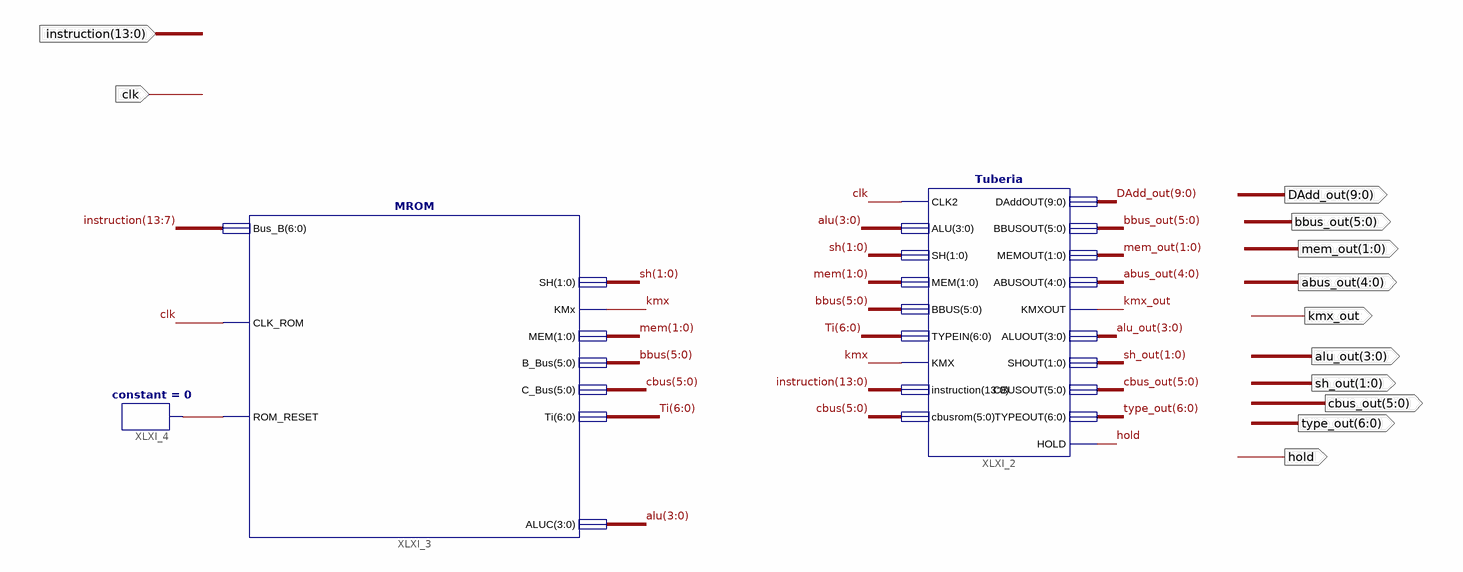
[diagram p0: schematic sheet 1]
// Xilinx ISE schematic merge.sch (artix7) as structural Verilog: 3 symbols, 12 ports
module merge (
  input  [13:0] instruction,
  input  clk,
  output [9:0] DAdd_out,
  output [5:0] bbus_out,
  output [1:0] mem_out,
  output [4:0] abus_out,
  output kmx_out,
  output [3:0] alu_out,
  output [1:0] sh_out,
  output hold,
  output [5:0] cbus_out,
  output [6:0] type_out
);

  wire kmx, XLXN_30;
  wire [1:0] mem, sh;
  wire [3:0] alu;
  wire [5:0] bbus, cbus;
  wire [6:0] Ti;

  Tuberia XLXI_2 (
    .CLK2(clk), .ALU(alu), .SH(sh), .MEM(mem), .BBUS(bbus), .TYPEIN(Ti), .KMX(kmx),
    .instruction(instruction), .cbusrom(cbus), .DAddOUT(DAdd_out), .BBUSOUT(bbus_out), .MEMOUT(mem_out),
    .ABUSOUT(abus_out), .KMXOUT(kmx_out), .ALUOUT(alu_out), .SHOUT(sh_out), .CBUSOUT(cbus_out),
    .TYPEOUT(type_out), .HOLD(hold));
  MROM XLXI_3 (
    .Bus_B(instruction[13:7]), .CLK_ROM(clk), .ROM_RESET(XLXN_30), .Ti(Ti), .C_Bus(cbus), .B_Bus(bbus),
    .MEM(mem), .KMx(kmx), .SH(sh), .ALUC(alu));
  constant #(.CValue("0")) XLXI_4 (.O(XLXN_30));
endmodule
